# Altium schematic sheet 3_INTERFACE_DOS_DRIVERS.SchDoc
size Tabloid; SheetNumber: 3; SheetTotal: 3; SPICEModelCacheFCVACYYO: <root> / <DocumentId>FCVACYYO</DocumentId> / </root>
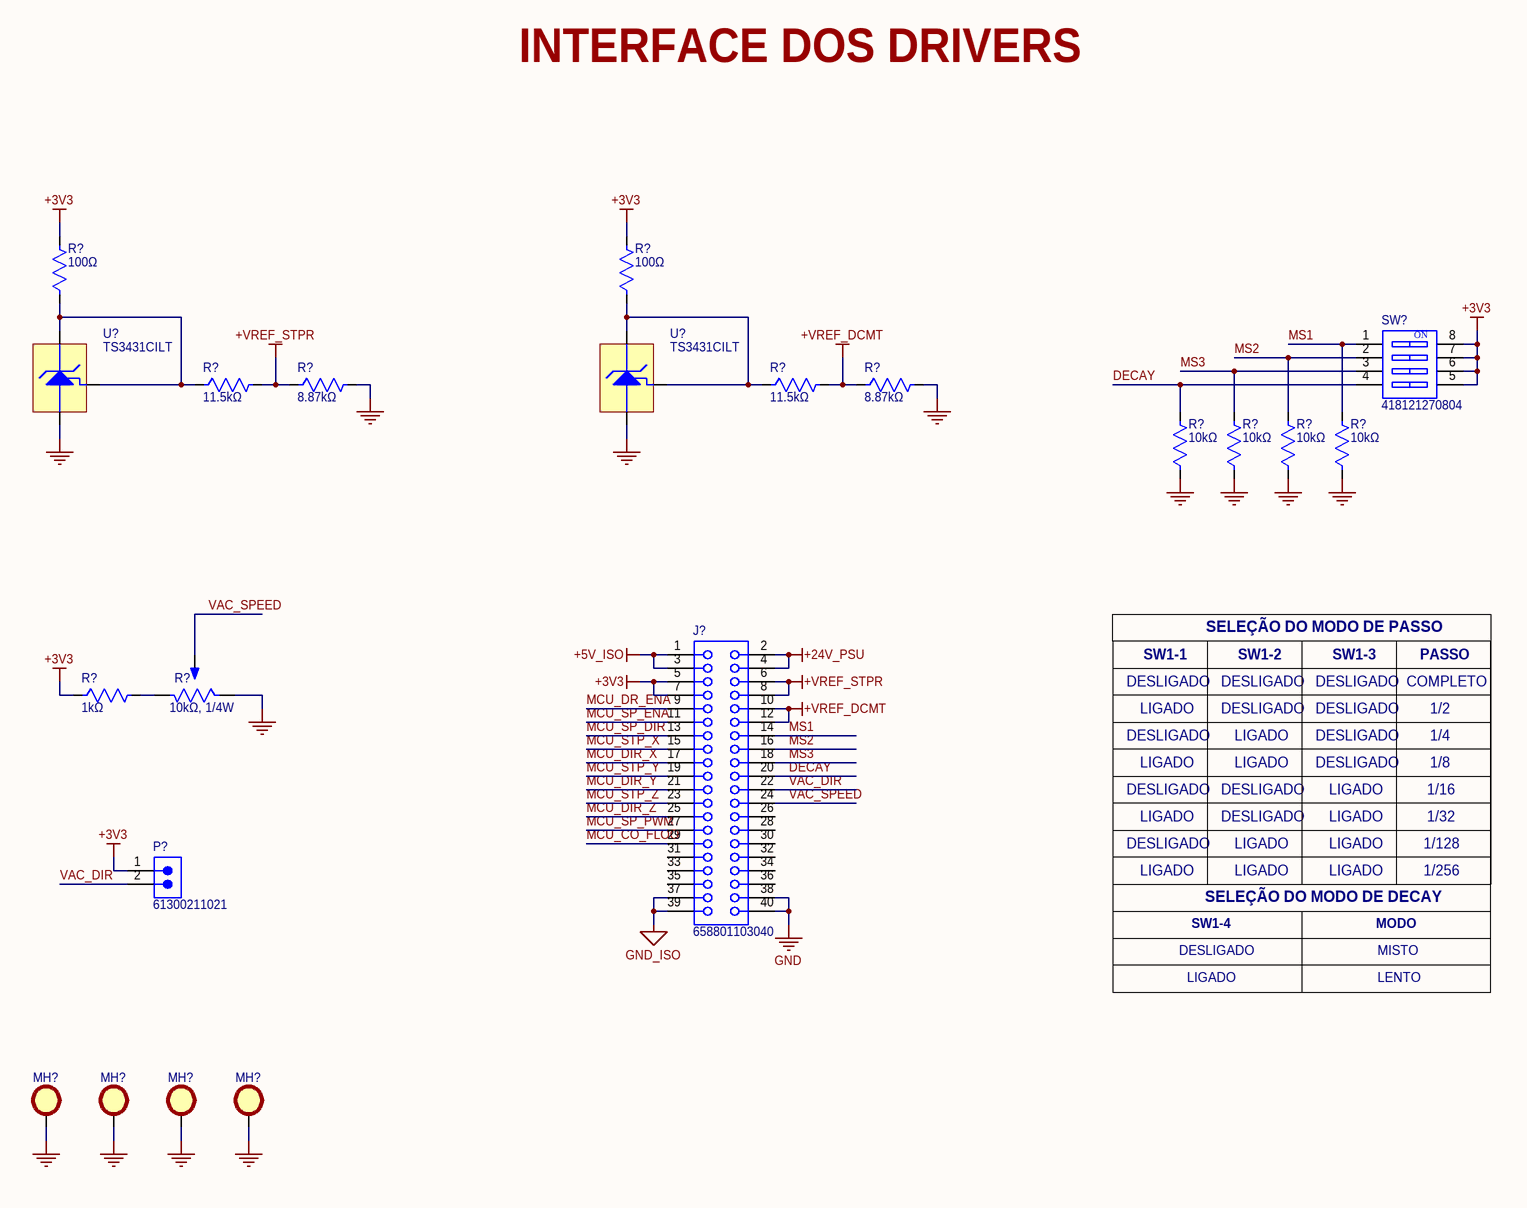
[diagram p0: 3_INTERFACE_DOS_DRIVERS.SchDoc]

## Parts
(Parts that share a designator on the sheet are numbered #1, #2 ... from top to bottom, then left to right.)
J?  658801103040  [658801103040]
MH?#1  Mounting Hole 2.5mm  [MOUNTING_HOLE_M2P5_PLATED]  (value not drawn)  (no BOM)
MH?#2  Mounting Hole 2.5mm  [MOUNTING_HOLE_M2P5_PLATED]  (value not drawn)  (no BOM)
MH?#3  Mounting Hole 2.5mm  [MOUNTING_HOLE_M2P5_PLATED]  (value not drawn)  (no BOM)
MH?#4  Mounting Hole 2.5mm  [MOUNTING_HOLE_M2P5_PLATED]  (value not drawn)  (no BOM)
P?  61300211021  [61300211021]
R?#1  100Ω  [0603-REFLOW]
R?#2  100Ω  [0603-REFLOW]
R?#3  11.5kΩ  [0603-REFLOW]
R?#4  8.87kΩ  [0603-REFLOW]
R?#5  11.5kΩ  [0603-REFLOW]
R?#6  8.87kΩ  [0603-REFLOW]
R?#7  10kΩ  [0603-REFLOW]
R?#8  10kΩ  [0603-REFLOW]
R?#9  10kΩ  [0603-REFLOW]
R?#10  10kΩ  [0603-REFLOW]
R?#11  1kΩ  [0603-REFLOW]
R?#12  10kΩ, 1/4W  [TRIM-3224W]
SW?  418121270804  [418121270804]
U?#1  TS3431CILT  [SOT-23-3]
U?#2  TS3431CILT  [SOT-23-3]

## Nets
+3V3: J?.5 J?.7 P?.1 R?#1.2 R?#2.2 R?#11.1 SW?.5 SW?.6 SW?.7 SW?.8
+5V_ISO: J?.1 J?.3
+24V_PSU: J?.2 J?.4
+VREF_DCMT: J?.10 J?.12 R?#5.2 R?#6.1
+VREF_STPR: J?.6 J?.8 R?#3.2 R?#4.1
GND: J?.38 J?.40 MH?#1.H MH?#2.H MH?#3.H MH?#4.H R?#4.2 R?#6.2 R?#7.1 R?#8.1 R?#9.1 R?#10.1 R?#12.1(CCW) U?#1.3(ANODE) U?#2.3(ANODE)
GND_ISO: J?.37 J?.39
DECAY: J?.20 R?#7.2 SW?.4
MCU_CO_FLOO: J?.29
MCU_DIR_X: J?.17
MCU_DIR_Y: J?.21
MCU_DIR_Z: J?.25
MCU_DR_ENA: J?.9
MCU_SP_DIR: J?.13
MCU_SP_ENA: J?.11
MCU_SP_PWM: J?.27
MCU_STP_X: J?.15
MCU_STP_Y: J?.19
MCU_STP_Z: J?.23
MS1: J?.14 R?#10.2 SW?.1
MS2: J?.16 R?#9.2 SW?.2
MS3: J?.18 R?#8.2 SW?.3
VAC_DIR: J?.22 P?.2
VAC_SPEED: J?.24 R?#12.2(WIPER)
NetR?#1_1: R?#1.1 R?#3.1 U?#1.1(REF) U?#1.2(CATHODE)
NetR?#2_1: R?#2.1 R?#5.1 U?#2.1(REF) U?#2.2(CATHODE)
NetR?#11_2: R?#11.2 R?#12.3(CW)

Not connected (* = marked no-connect by the designer): J? 26 28 30 31 32 33 34 35 36

## Notes on the sheet
- INTERFACE DOS DRIVERS
- SW1-1
- SELEÇÃO DO MODO DE PASSO
- SW1-2
- SW1-3
- PASSO
- DESLIGADO
- LIGADO
- COMPLETO
- 1/2
- 1/4
- 1/16
- 1/8
- 1/128
- 1/256
- 1/32
- SW1-4
- SELEÇÃO DO MODO DE DECAY
- MODO
- LENTO
- MISTO
- Title:
- Size:
- Tabloid
- Number:
- Sheet of:
- Revision:
- Date:
- Project Name:
- Drawn By:
- (in symbol 418121270804) ON

## Library data of the parts
J? = 658801103040: WR-BTB Board to Board Connector, Female Receptacle, height 11.75mm, pitch 0.8mm, 40p; Manufacturer: Wurth Elektronik; Contact Resistance: 50mohm; Rated Current: 500mA; Working Voltage: 50VAC; Manufacturer Part Number: 658801103040; Category: Board-to-Board Connector; Match Code: WR-BTB; ComponentLink1Description: Website Link; ComponentLink1URL: https://www.we-online.com/redexpert/article/658801103040?ad; ComponentLink2Description: Datasheet Link; ComponentLink2URL: https://www.we-online.com/redexpert/spec/658801103040?ad; Mount: Surface Mount; Operating Temperature Min: -55degC; Operating Temperature Max: 85degC; Packaging: Tape and Reel; Height: 11.75mm; Gender: Female Receptacle; Number of Pins: 40; Lead Pitch: 0.8mm
MH?#1-MH?#4 = MTH-2P5MM-PLATED: PLATED MOUNTING HOLE WITH 2.5MM DIAMETER
P? = 61300211021: WR-PHD Pin Header, THT, Angled, pitch 2.54mm, 1 Row, 2P; Manufacturer: Wurth Elektronik; Contact Resistance: 20mOhm; Rated Current: 3A; Working Voltage: 250V; Withstanding Voltage: 500V; Manufacturer Part Number: 61300211021; Category: Board-to-Board Connectors; Match Code: WR-PHD; ComponentLink1Description: Website Link; ComponentLink1URL: https://www.we-online.com/redexpert/article/61300211021?ad; ComponentLink2Description: Datasheet Link; ComponentLink2URL: https://www.we-online.com/redexpert/spec/61300211021?ad; Mount: Through Hole; Operating Temperature Min: -40degC; Operating Temperature Max: 105degC; Packaging: Bag; Gender: Pin Header; Number of Pins: 2; Number of Rows: 1; Orientation: Angled; Lead Pitch: 2.54mm
R?#1 R?#2 = RC0603FR-07100RL: RES 100 OHM 1% 1/10W 0603; Manufacturer: Yageo Group; Max Power Dissipation: 100mW; Temperature Coefficient: ±200ppm/°C; Voltage Rating (AC): 50V; Voltage Rating: 75V; Supplier Part Number: 311-100HRCT-ND; Manufacturer Part Number: RC0603FR-07100RL; Value: 100Ω; Case Code (Imperial): 0603; Case Code (Metric): 1608; Case/Package: 0603; Category: Chip SMD Resistors; China RoHS: Non-Compliant; Composition: Thick Film; Contact Plating: Tin; Depth: 800µm; Features: Moisture Resistant; Height: 450µm; Lead Free: Lead Free; Length: 1.6mm; Lifecycle Status: Production; Max Operating Temperature: 155°C; Military Standard: Not; Min Operating Temperature: -55°C; Mounting Technology: Surface Mount; Number of Terminals: 2; Number of Terminations: 2; Packaging: Tape & Reel; Power Dissipation: 100mW; Power Rating: 100mW; Radiation Hardening: No; REACH SVHC: Yes; RoHS: Compliant; Supplier: DigiKey; Termination: SMD/SMT; Tolerance: 1%; Component Link Description: https://www.yageogroup.com/content/datasheet/asset/file/PYU-RC_GROUP_51_ROHS_L; Component Link URL: https://www.yageogroup.com/content/datasheet/asset/file/PYU-RC_GROUP_51_ROHS_L; Datasheet: https://www.yageogroup.com/content/datasheet/asset/file/PYU-RC_GROUP_51_ROHS_L; Voltage Rating (DC): 50V; Weight: 2.012816mg; Width: 800µm; Working Voltage: 75V
R?#3 R?#5 = RC0603FR-0711K5L: RES 11.5K OHM 1% 1/10W 0603; Manufacturer: Yageo Group; Max Power Dissipation: 100mW; Temperature Coefficient: ±200ppm/°C; Voltage Rating (AC): 50V; Voltage Rating: 75V; Supplier Part Number: 311-11.5KHRCT-ND; Manufacturer Part Number: RC0603FR-0711K5L; Value: 11.5kΩ; Case Code (Imperial): 0603; Case Code (Metric): 1608; Case/Package: 0603; Category: Chip SMD Resistors; China RoHS: Non-Compliant; Composition: Thick Film; Contact Plating: Tin; Depth: 800µm; Features: Moisture Resistant; Height: 450µm; Lead Free: Lead Free; Length: 1.6mm; Lifecycle Status: Production; Max Operating Temperature: 155°C; Military Standard: Not; Min Operating Temperature: -55°C; Mounting Technology: Surface Mount; Number of Terminals: 2; Number of Terminations: 2; Packaging: Tape & Reel; Power Dissipation: 100mW; Power Rating: 100mW; Radiation Hardening: No; REACH SVHC: Yes; RoHS: Compliant; Supplier: DigiKey; Termination: SMD/SMT; Tolerance: 1%; Component Link Description: https://www.yageogroup.com/content/datasheet/asset/file/PYU-RC_GROUP_51_ROHS_L; Component Link URL: https://www.yageogroup.com/content/datasheet/asset/file/PYU-RC_GROUP_51_ROHS_L; Datasheet: https://www.yageogroup.com/content/datasheet/asset/file/PYU-RC_GROUP_51_ROHS_L; Voltage Rating (DC): 50V; Weight: 2.012816mg; Width: 800µm; Working Voltage: 75V
R?#4 R?#6 = RC0603FR-078K87L: RES 8.87K OHM 1% 1/10W 0603; Manufacturer: Yageo Group; Max Power Dissipation: 100mW; Temperature Coefficient: ±200ppm/°C; Voltage Rating (AC): 50V; Voltage Rating: 75V; Supplier Part Number: 311-8.87KHRCT-ND; Manufacturer Part Number: RC0603FR-078K87L; Value: 8.87kΩ; Case Code (Imperial): 0603; Case Code (Metric): 1608; Case/Package: 0603; Category: Chip SMD Resistors; China RoHS: Non-Compliant; Composition: Thick Film; Contact Plating: Tin; Depth: 800µm; Features: Moisture Resistant; Height: 450µm; Lead Free: Lead Free; Length: 1.6mm; Lifecycle Status: Production; Max Operating Temperature: 155°C; Military Standard: Not; Min Operating Temperature: -55°C; Mounting Technology: Surface Mount; Number of Terminals: 2; Number of Terminations: 2; Packaging: Tape & Reel; Power Dissipation: 100mW; Power Rating: 100mW; Radiation Hardening: No; REACH SVHC: Yes; RoHS: Compliant; Supplier: DigiKey; Termination: SMD/SMT; Tolerance: 1%; Component Link Description: https://www.yageogroup.com/content/datasheet/asset/file/PYU-RC_GROUP_51_ROHS_L; Component Link URL: https://www.yageogroup.com/content/datasheet/asset/file/PYU-RC_GROUP_51_ROHS_L; Datasheet: https://www.yageogroup.com/content/datasheet/asset/file/PYU-RC_GROUP_51_ROHS_L; Voltage Rating (DC): 50V; Weight: 2.012816mg; Width: 800µm; Working Voltage: 75V
R?#7-R?#10 = RC0603FR-0710KL: RES 10K OHM 1% 1/10W 0603; Manufacturer: Yageo Group; Max Power Dissipation: 100mW; Temperature Coefficient: ±200ppm/°C; Voltage Rating (AC): 50V; Voltage Rating: 75V; Supplier Part Number: 311-10.0KHRCT-ND; Manufacturer Part Number: RC0603FR-0710KL; Value: 10kΩ; Case Code (Imperial): 0603; Case Code (Metric): 1608; Case/Package: 0603; Category: Chip SMD Resistors; China RoHS: Non-Compliant; Composition: Thick Film; Contact Plating: Tin; Depth: 800µm; Features: Moisture Resistant; Height: 450µm; Lead Free: Lead Free; Length: 1.6mm; Lifecycle Status: Production; Max Operating Temperature: 155°C; Military Standard: Not; Min Operating Temperature: -55°C; Mounting Technology: Surface Mount; Number of Terminals: 2; Number of Terminations: 2; Packaging: Tape & Reel; Power Dissipation: 100mW; Power Rating: 100mW; Radiation Hardening: No; REACH SVHC: Yes; RoHS: Compliant; Supplier: DigiKey; Termination: SMD/SMT; Tolerance: 1%; Component Link Description: https://www.yageogroup.com/content/datasheet/asset/file/PYU-RC_GROUP_51_ROHS_L; Component Link URL: https://www.yageogroup.com/content/datasheet/asset/file/PYU-RC_GROUP_51_ROHS_L; Datasheet: https://www.yageogroup.com/content/datasheet/asset/file/PYU-RC_GROUP_51_ROHS_L; Voltage Rating (DC): 50V; Weight: 2.012816mg; Width: 800µm; Working Voltage: 75V
R?#11 = RC0603FR-071KL: RES 1K OHM 1% 1/10W 0603; Manufacturer: Yageo Group; Max Power Dissipation: 100mW; Temperature Coefficient: ±200ppm/°C; Voltage Rating (AC): 50V; Voltage Rating: 75V; Supplier Part Number: 311-1.00KHRCT-ND; Manufacturer Part Number: RC0603FR-071KL; Value: 1kΩ; Case Code (Imperial): 0603; Case Code (Metric): 1608; Case/Package: 0603; Category: Chip SMD Resistors; China RoHS: Non-Compliant; Composition: Thick Film; Contact Plating: Tin; Depth: 800µm; Features: Moisture Resistant; Height: 450µm; Lead Free: Lead Free; Length: 1.6mm; Lifecycle Status: Production; Max Operating Temperature: 155°C; Military Standard: Not; Min Operating Temperature: -55°C; Mounting Technology: Surface Mount; Number of Terminals: 2; Number of Terminations: 2; Packaging: Tape & Reel; Power Dissipation: 100mW; Power Rating: 100mW; Radiation Hardening: No; REACH SVHC: Yes; RoHS: Compliant; Supplier: DigiKey; Termination: SMD/SMT; Tolerance: 1%; Component Link Description: https://www.yageogroup.com/content/datasheet/asset/file/PYU-RC_GROUP_51_ROHS_L; Component Link URL: https://www.yageogroup.com/content/datasheet/asset/file/PYU-RC_GROUP_51_ROHS_L; Datasheet: https://www.yageogroup.com/content/datasheet/asset/file/PYU-RC_GROUP_51_ROHS_L; Voltage Rating (DC): 50V; Weight: 2.012816mg; Width: 800µm; Working Voltage: 75V
R?#12 = 3224W-1-103G: TRIMMER 10K OHM 0.25W J LEAD TOP; Manufacturer: Bourns; Max Power Dissipation: 250mW; Number of Turns: 12; Temperature Coefficient: 100ppm/°C; Tolerance: 10%; Working Voltage: 300V; Supplier: DigiKey; Supplier Part Number: 3224W-1-103GCT-ND; Manufacturer Part Number: 3224W-1-103G; RoHS: Compliant; Category: Variable Resistors and Potentiometers; Stock: 792; Pricing: 1=3.93, 10=3.271, 25=3.038, 50=2.8722, 100=2.7147, 250=2.51884, 500=2.3796 (USD); Composition: Cermet; Depth: 3.9mm; Height: 5.1mm; Length: 4.8mm; Lifecycle Status: Production; Max Operating Temperature: 150°C; Military Standard: Not; Min Operating Temperature: -65°C; Mounting Technology: Surface Mount; Number of Terminals: 3; Packaging: Tape & Reel (TR); Power Rating: 250mW; REACH SVHC: No; Value: 10kΩ; Termination: SMD/SMT; Width: 3.5mm; ComponentLink1URL: https://datasheet.octopart.com:443/3224W-1-103G-Bourns-datasheet-182141393.pdf?src-supplier=IHS; ComponentLink1Description: https://datasheet.octopart.com:443/3224W-1-103G-Bourns-datasheet-182141393.pdf?src-supplier=IHS; ComponentLink2URL: https://datasheet.octopart.com:443/3224W-1-103G-Bourns-datasheet-156011607.pdf?src-supplier=element14+APAC; ComponentLink2Description: https://datasheet.octopart.com:443/3224W-1-103G-Bourns-datasheet-156011607.pdf?src-supplier=element14+APAC; ComponentLink3URL: https://datasheet.octopart.com:443/3224W-1-103G-Bourns-datasheet-64275176.pdf?src-supplier=Master+Electronics; ComponentLink3Description: https://datasheet.octopart.com:443/3224W-1-103G-Bourns-datasheet-64275176.pdf?src-supplier=Master+Electronics; ComponentLink4URL: https://datasheet.octopart.com:443/3224W-1-103G-Bourns-datasheet-11533694.pdf?src-supplier=Arrow+Electronics; ComponentLink4Description: https://datasheet.octopart.com:443/3224W-1-103G-Bourns-datasheet-11533694.pdf?src-supplier=Arrow+Electronics; ComponentLink5URL: http://sigma.octopart.com:80/conflict_mineral_statement/Bourns-company-36.pdf?src-supplier=Compliance+Statements; ComponentLink5Description: http://sigma.octopart.com:80/conflict_mineral_statement/Bourns-company-36.pdf?src-supplier=Compliance+Statements
SW? = 418121270804: WS-DISV Small Compact SMT Dip Switch, Raised Actuator, pitch 2.54mm, 4p; Manufacturer: Wurth Elektronik; Actuator Type: Raise Type; Operation Force: 600g; Number of Poles: 4; Rated Current Non-Switching: 100mA; Rated Current Switching: 25mA; Rated Voltage Non-Switching: 50VDC; Rated Voltage Switching: 24VDC; Manufacturer Part Number: 418121270804; Category: Dip Switches; Match Code: WS-DISV; ComponentLink1Description: Website Link; ComponentLink1URL: https://www.we-online.com/redexpert/article/418121270804?ad; ComponentLink2Description: Datasheet Link; ComponentLink2URL: https://www.we-online.com/redexpert/spec/418121270804?ad; Mount: Surface Mount; Operating Temperature Min: -40degC; Operating Temperature Max: 85degC; Packaging: Tape and Reel; Contact Material: Copper Alloy; Contact Plating: Gold; Pitch: 2.54mm
U?#1 U?#2 = TS3431CILT: IC VREF SHUNT ADJ 0.25% SOT23-3; Manufacturer: STMicroelectronics; Cathode Current: 400µA; Max Supply Voltage: 25V; Max Output current: 100mA; Max Output Voltage: 1.243V; Min Output Voltage: 1.237V; Min Supply Voltage: 1.24V; Number of Channels: 1; Output Voltage: 24V; Reference Type: Adjustable, Shunt; Temperature Coefficient: 100ppm/°C; Supplier: DigiKey; Supplier Part Number: 497-4637-1-ND; Manufacturer Part Number: TS3431CILT; RoHS: Compliant; Category: Voltage References; Stock: 16066; Pricing: 1=0.62, 10=0.44, 25=0.3944, 100=0.3441, 250=0.32016, 500=0.30574, 1000=0.29386 (USD); Case/Package: SOT-23; China RoHS: Compliant; Height: 1.02mm; Height - Seated (Max): 1.12mm; Lead Free: Lead Free; Length: 2.9mm; Lifecycle Status: Production; Max Operating Temperature: 125°C; Min Operating Temperature: -40°C; Mounting Technology: Surface Mount; Nominal Supply Voltage: 1.24V; Nominal Output Voltage: 1.24V; Nominal Supply Current: 400µA; Number of Circuits: 1; Number of Outputs: 1; Pins: 3; Number of Terminals: 3; Output Current: 100mA; Packaging: Tape and Reel; Radiation Hardening: No; REACH SVHC: Yes; Reference Voltage: 1.24V; Schedule B: 8542390000, 8542390000|8542390000|8542390000|8542390000|8542390000; Terminal Pitch: 950µm; Termination: SMD/SMT; Tolerance: 0.25%; Width: 1.3mm; ComponentLink1URL: https://datasheet.octopart.com:443/TS3431CILT-STMicroelectronics-datasheet-12523092.pdf?src-supplier=SHENGYU+ELECTRONICS; ComponentLink1Description: https://datasheet.octopart.com:443/TS3431CILT-STMicroelectronics-datasheet-12523092.pdf?src-supplier=SHENGYU+ELECTRONICS; ComponentLink2URL: https://datasheet.octopart.com:443/TS3431CILT-STMicroelectronics-datasheet-10408717.pdf?src-supplier=Upverter; ComponentLink2Description: https://datasheet.octopart.com:443/TS3431CILT-STMicroelectronics-datasheet-10408717.pdf?src-supplier=Upverter; ComponentLink3URL: https://datasheet.octopart.com:443/TS3431CILT-STMicroelectronics-datasheet-124172.pdf?src-supplier=Farnell; ComponentLink3Description: https://datasheet.octopart.com:443/TS3431CILT-STMicroelectronics-datasheet-124172.pdf?src-supplier=Farnell; ComponentLink4URL: https://datasheet.octopart.com:443/TS3431CILT-STMicroelectronics-datasheet-140368796.pdf?src-supplier=TME; ComponentLink4Description: https://datasheet.octopart.com:443/TS3431CILT-STMicroelectronics-datasheet-140368796.pdf?src-supplier=TME; ComponentLink5URL: https://datasheet.octopart.com:443/TS3431CILT-STMicroelectronics-datasheet-18487.pdf?src-supplier=DigiKey; ComponentLink5Description: https://datasheet.octopart.com:443/TS3431CILT-STMicroelectronics-datasheet-18487.pdf?src-supplier=DigiKey